# Altium project SpaceWallACPowerDistribution.PrjPcb (part 1 of 3)
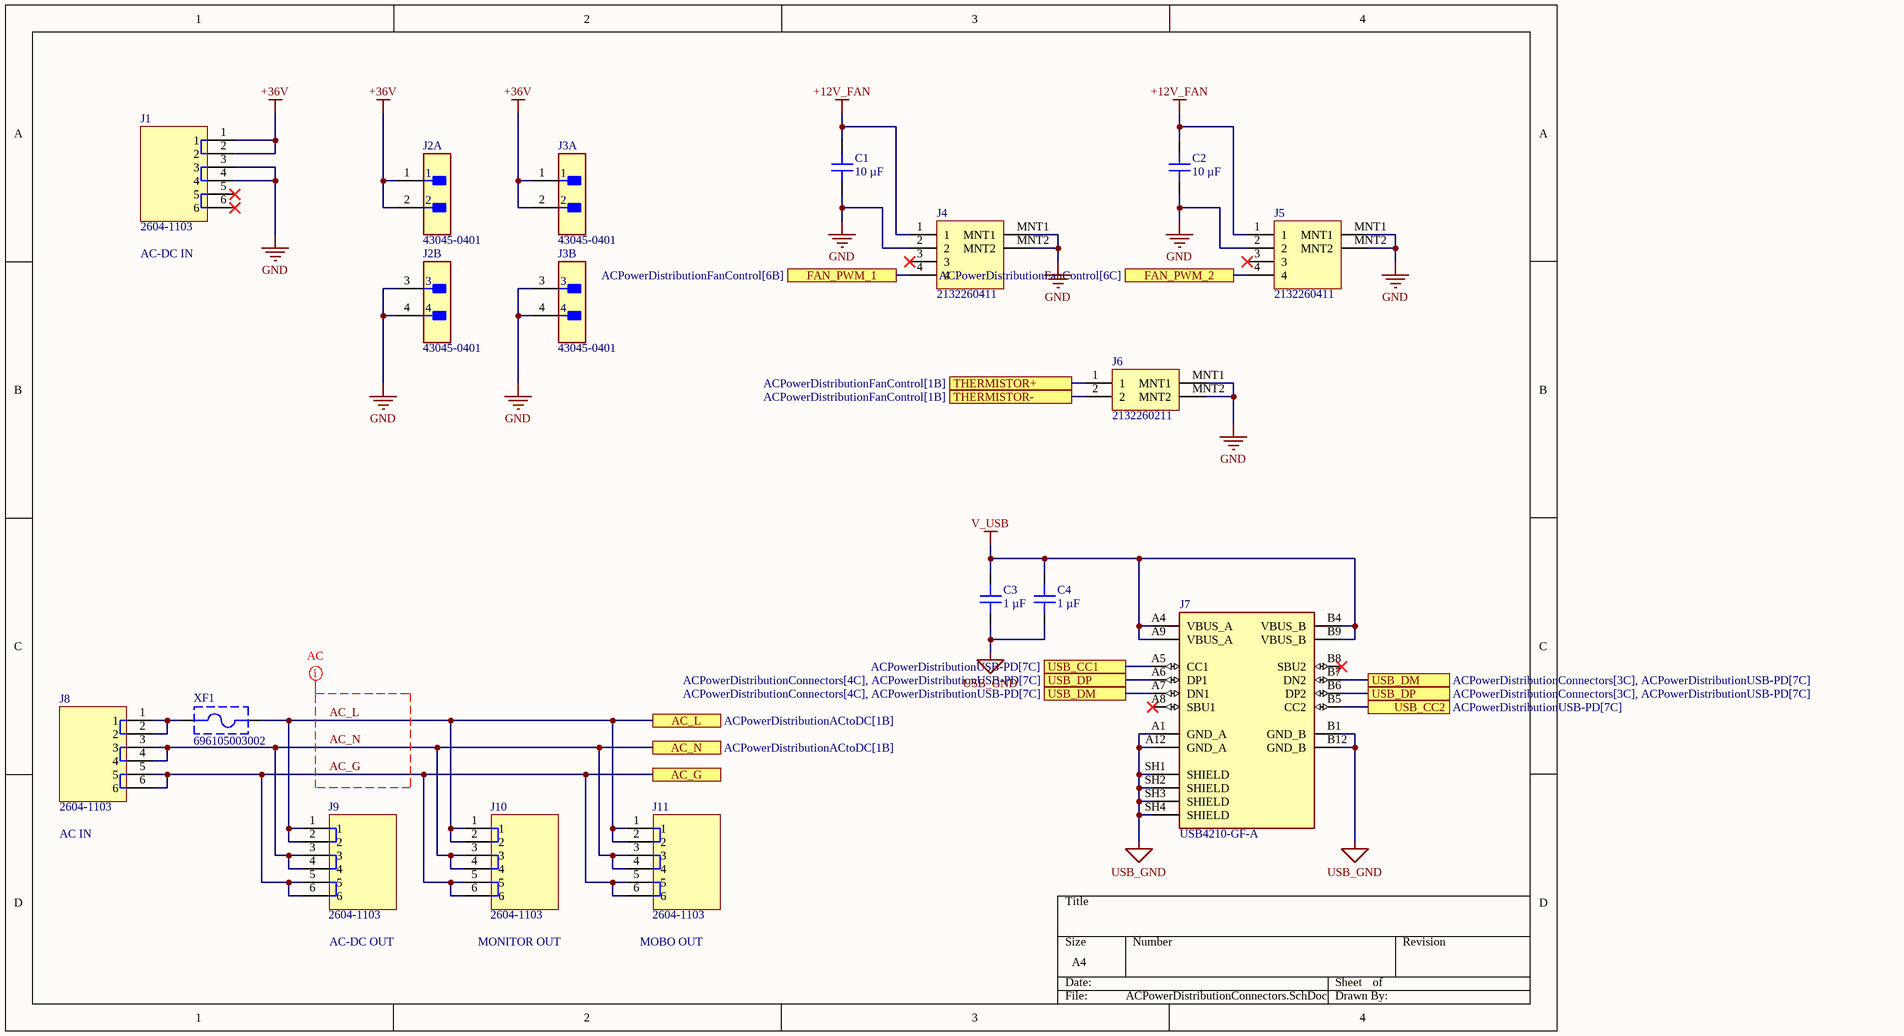
[diagram p0: ACPowerDistributionConnectors.SchDoc]
5 sheets, 157 parts. Net scope: flat (ports and power ports of the same name join across sheets).
Board file: ACPowerDistributionPCB.PcbDoc
Sheets:
  ACPowerDistributionConnectors.SchDoc
  ACPowerDistributionACtoDC.SchDoc
  ACPowerDistributionDCtoDC.SchDoc
  ACPowerDistributionUSB-PD.SchDoc
  ACPowerDistributionFanControl.SchDoc

## Sheet ACPowerDistributionConnectors.SchDoc
size A4; SheetNumber: 1; SheetTotal: 5

### Parts
C1  10 µF  [CAP 1210_3225 - 1MM]
C2  10 µF  [CAP 1210_3225 - 1MM]
C3  1 µF  [CAP 0603_1608]
C4  1 µF  [CAP 0603_1608]
J1  2604-1103  [2604-1103]
J2  43045-0401  [FP-43045-0401-MFG]  (parts A,B of 2)
J3  43045-0401  [FP-43045-0401-MFG]  (parts A,B of 2)
J4  2132260411  [2132260411]
J5  2132260411  [2132260411]
J6  2132260211  [2132260211]
J7  USB4210-GF-A  [USB4210-GF-A]
J8  2604-1103  [2604-1103]
J9  2604-1103  [2604-1103]
J10  2604-1103  [2604-1103]
J11  2604-1103  [2604-1103]
XF1  696105003002  [696105003002]

### Ports
AC_G, AC_L (see ACPowerDistributionACtoDC[1B]), AC_N (see ACPowerDistributionACtoDC[1B]), FAN_PWM_1 (see ACPowerDistributionFanControl[6B]), FAN_PWM_2 (see ACPowerDistributionFanControl[6C]), THERMISTOR+ (see ACPowerDistributionFanControl[1B]), THERMISTOR- (see ACPowerDistributionFanControl[1B]), USB_CC1 (see ACPowerDistributionUSB-PD[7C]), USB_CC2 (see ACPowerDistributionUSB-PD[7C]), USB_DM (see ACPowerDistributionConnectors[3C], ACPowerDistributionUSB-PD[7C]), USB_DM (see ACPowerDistributionConnectors[4C], ACPowerDistributionUSB-PD[7C]), USB_DP (see ACPowerDistributionConnectors[3C], ACPowerDistributionUSB-PD[7C]), USB_DP (see ACPowerDistributionConnectors[4C], ACPowerDistributionUSB-PD[7C])

### Nets
+5V: J6.1 ; port THERMISTOR+
+12V_FAN: C1.2 C2.2 J4.1 J5.1
+36V: J1.1 J1.2 J2.1 J2.2 J3.1 J3.2
GND: C1.1 C2.1 J1.3 J1.4 J2.3 J2.4 J3.3 J3.4 J4.2 J4.MNT1 J4.MNT2 J5.2 J5.MNT1 J5.MNT2 J6.MNT1 J6.MNT2
USB_GND: C3.1 C4.1 J7.A1(GND_A) J7.A12(GND_A) J7.B1(GND_B) J7.B12(GND_B) J7.SH1(SHIELD) J7.SH2(SHIELD) J7.SH3(SHIELD) J7.SH4(SHIELD)
V_USB: C3.2 C4.2 J7.A4(VBUS_A) J7.A9(VBUS_A) J7.B4(VBUS_B) J7.B9(VBUS_B)
AC_G: J8.5 J8.6 J9.5 J9.6 J10.5 J10.6 J11.5 J11.6 ; port AC_G
AC_L: J9.1 J9.2 J10.1 J10.2 J11.1 J11.2 XF1.2 ; port AC_L
AC_N: J8.3 J8.4 J9.3 J9.4 J10.3 J10.4 J11.3 J11.4 ; port AC_N
FAN_PWM_1: J4.4 ; port FAN_PWM_1
FAN_PWM_2: J5.4 ; port FAN_PWM_2
THERM_IN: J6.2 ; port THERMISTOR-
USB_CC1: J7.A5(CC1) ; port USB_CC1
USB_CC2: J7.B5(CC2) ; port USB_CC2
USB_DM: J7.A7(DN1) J7.B7(DN2) ; port USB_DM
USB_DP: J7.A6(DP1) J7.B6(DP2) ; port USB_DP
NetJ8_1: J8.1 J8.2 XF1.1

Not connected (* = marked no-connect by the designer): J1 5* 6*; J4 3*; J5 3*; J7 A8(SBU1)* B8(SBU2)*

### Layout directives
net class AC: AC_G, AC_L, AC_N

### Notes on the sheet
- (near J1) AC-DC IN
- AC IN
- (near J9) AC-DC OUT
- (near J10) MONITOR OUT
- (near J11) MOBO OUT

### Library data of the parts
C1 C2 = CGA6P1X7R1N106K250AC: CAP CER 10UF 75V X7R 1210; manufacturer: TDK Corporation; Tolerance: ±10%; Part Number: CGA6P1X7R1N106K250AC; Value: 10 µF; Applications: Automotive; Capacitance: 10 µF; componentlink1description: Datasheet; componentlink1url: https://product.tdk.com/info/en/catalog/datasheets/mlcc_automotive_general_en.pdf?ref_disty=digikey; componentlink2description: DigiKey Link; componentlink2url: https://www.digikey.com/en/products/detail/tdk-corporation/CGA6P1X7R1N106K250AC/10240635; Device Package: 1210 (3225 Metric); lastupdated: 6/4/2024 7:21:00 PM; Lifecycle Status: Active; Minimum Order: 1; Mounting Type: Surface Mount, MLCC; Operating Temperature: -55°C ~ 125°C; Package / Case: 1210 (3225 Metric); packaging: TapeAndReel; partid: 40572; Part Status: Active; price: 0.30; series: CGA; Size / Dimension: 0.126" L x 0.098" W (3.20mm x 2.50mm); Supplier 1: DigiKey; Supplier Part Number 1: 445-181658-1-ND; Temperature Coefficient: X7R; Thickness (Max): 0.110" (2.80mm); Voltage - Rated: 75V; Features: Low ESL; Ratings: AEC-Q200
C3 C4 = CL10A105KA8NNNC: CAP CER 1UF 25V X5R 0603; manufacturer: Samsung Electro-Mechanics; Tolerance: ±10%; Part Number: CL10A105KA8NNNC; Capacitance: 1 µF; Applications: General Purpose; componentlink1description: Datasheet; componentlink1url: http://www.samsungsem.com/kr/support/product-search/mlcc/CL10A105KA8NNNC.jsp; componentlink2description: DigiKey Link; componentlink2url: https://www.digikey.com/en/products/detail/samsung-electro-mechanics/CL10A105KA8NNNC/3886760; Device Package: 0603 (1608 Metric); lastupdated: 2/9/2024 8:10:26 PM; Lifecycle Status: Active; Minimum Order: 1; Mounting Type: Surface Mount, MLCC; Operating Temperature: -55°C ~ 85°C; Package / Case: 0603 (1608 Metric); packaging: TapeAndReel; partid: 5508; Part Status: Active; price: 0.01; series: CL; Size / Dimension: 0.063" L x 0.031" W (1.60mm x 0.80mm); Supplier 1: DigiKey; Supplier Part Number 1: 1276-1102-1-ND; Temperature Coefficient: X5R; Thickness (Max): 0.035" (0.90mm); value: 1 µF; Voltage - Rated: 25V
J2 J3 = CMP-04776-000440-1: MICROFIT 3.0 RA HDR W/TH DR 15AU; Row Spacing: 3mm; Max Current Rating: 5A; Gender: Male; Number of Contacts: 4; Voltage Rating: 250V; Max Voltage Rating (DC): 250.25kV; Glow Wire Compliant: Compliant; Contact Resistance: 10mR; System: Connector; RoHS Compliant: Yes; Max Operating Temperature: 105°C; Number of Rows: 2; Mount: Through Hole; Color: Black; Packaging: Tray; Series: 43045; Current Rating: 5A; Pitch: 3mm; Package Quantity: 2232; Depth: 12.2mm; Radiation Hardening: No; Height: 8.77mm; Contact Material: Brass; Length: 10.15mm; Contact Plating: Gold; Flammability Rating: UL94 V-0; Termination: Solder; Min Operating Temperature: -40°C; Housing Color: Black; Orientation: Right Angle; Number of Positions: 4; Case/Package: SMC; Number of Circuits: 4; Housing Material: Thermoplastic; Halogen Free: Low Halogen
XF1 = CMP-1502-00234-2: NexarPartId: 56808804; Voltage Rating (AC): 250V; Fuse Current: 10A; RoHS: Non-Compliant; REACH SVHC: Unknown; Packaging: Box; Mount: Through Hole
J1 J8-J11 = 2604-1103: Supplier 1: DigiKey; Supplier Part Number 1: 2946-2604-1103-ND
J4 J5 = 2132260411: Supplier 1: DigiKey; Supplier Part Number 1: 900-2132260411CT-ND
J6 = 2132260211: Supplier 1: DigiKey; Supplier Part Number 1: 900-2132260211CT-ND
J7 = USB4210-GF-A: Supplier 1: DigiKey; Supplier Part Number 1: 2073-USB4210-GF-ACT-ND

## Sheet ACPowerDistributionACtoDC.SchDoc
size A; SheetNumber: 2; SheetTotal: 5
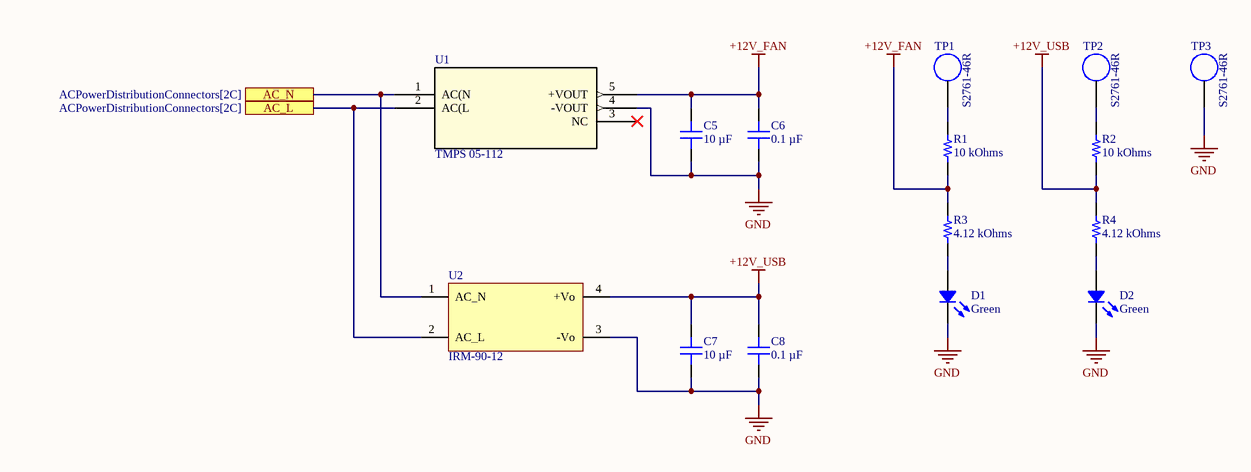
[diagram p1: ACPowerDistributionACtoDC.SchDoc]

### Parts
C5  10 µF  [CAP 1210_3225 - 1MM]
C6  0.1 µF  [CAP 0603_1608]
C7  10 µF  [CAP 1210_3225 - 1MM]
C8  0.1 µF  [CAP 0603_1608]
D1  Green  [LED 0603_1608 GREEN]
D2  Green  [LED 0603_1608 GREEN]
R1  10 kOhms  [RES 0603_1608]
R2  10 kOhms  [RES 0603_1608]
R3  4.12 kOhms  [RES 0603_1608]
R4  4.12 kOhms  [RES 0603_1608]
TP1  S2761-46R  [S2761-46R]
TP2  S2761-46R  [S2761-46R]
TP3  S2761-46R  [S2761-46R]
U1  TMPS 05-112  [TMPS05_TRP]
U2  IRM-90-12  [IRM-90-12]

### Ports
AC_L (see ACPowerDistributionConnectors[2C]), AC_N (see ACPowerDistributionConnectors[2C])

### Nets
+12V_FAN: C5.2 C6.2 R1.1 R3.2 U1.5(+VOUT)
+12V_USB: C7.2 C8.2 R2.1 R4.2 U2.4(+Vo)
GND: C5.1 C6.1 C7.1 C8.1 D1.2 D2.2 TP3.1 U1.4(-VOUT) U2.3(-Vo)
AC_L: U1.2(AC(L) U2.2(AC_L) ; port AC_L
AC_N: U1.1(AC(N) U2.1(AC_N) ; port AC_N
NetD1_1: D1.1 R3.1
NetD2_1: D2.1 R4.1
NetR1_2: R1.2 TP1.1
NetR2_2: R2.2 TP2.1

Not connected (* = marked no-connect by the designer): U1 3(NC)*

### Library data of the parts
C5 C7 = CGA6P1X7R1N106K250AC: as C1 on sheet ACPowerDistributionConnectors; Part Number: CGA6P1X7R1N106K250AC; Value: 10 µF; Applications: Automotive; Capacitance: 10 µF; componentlink1description: Datasheet; componentlink1url: https://product.tdk.com/info/en/catalog/datasheets/mlcc_automotive_general_en.pdf?ref_disty=digikey; componentlink2description: DigiKey Link; componentlink2url: https://www.digikey.com/en/products/detail/tdk-corporation/CGA6P1X7R1N106K250AC/10240635; Device Package: 1210 (3225 Metric); lastupdated: 6/4/2024 7:21:00 PM; Lifecycle Status: Active; Minimum Order: 1; Mounting Type: Surface Mount, MLCC; Operating Temperature: -55°C ~ 125°C; Package / Case: 1210 (3225 Metric); packaging: TapeAndReel; partid: 40572; Part Status: Active; price: 0.30; series: CGA; Size / Dimension: 0.126" L x 0.098" W (3.20mm x 2.50mm); Supplier 1: DigiKey; Supplier Part Number 1: 445-181658-1-ND; Temperature Coefficient: X7R; Thickness (Max): 0.110" (2.80mm); Voltage - Rated: 75V; Features: Low ESL; Ratings: AEC-Q200
C6 C8 = CL10B104KA8WPNC: CAP CER 0.1UF 25V X7R 0603; manufacturer: Samsung Electro-Mechanics; Tolerance: ±10%; Part Number: CL10B104KA8WPNC; Capacitance: 0.1 µF; Applications: Automotive; componentlink1description: Datasheet; componentlink1url: http://www.samsungsem.com/kr/support/product-search/mlcc/CL10B104KA8WPNC.jsp; componentlink2description: DigiKey Link; componentlink2url: https://www.digikey.com/en/products/detail/samsung-electro-mechanics/CL10B104KA8WPNC/5961201; Device Package: 0603 (1608 Metric); Features: Open Mode; lastupdated: 2/9/2024 8:10:26 PM; Lifecycle Status: Active; Minimum Order: 1; Mounting Type: Surface Mount, MLCC; Operating Temperature: -55°C ~ 125°C; Package / Case: 0603 (1608 Metric); packaging: TapeAndReel; partid: 5631; Part Status: Active; price: 0.01; Ratings: AEC-Q200; series: CL; Size / Dimension: 0.063" L x 0.031" W (1.60mm x 0.80mm); Supplier 1: DigiKey; Supplier Part Number 1: 1276-6717-1-ND; Temperature Coefficient: X7R; Thickness (Max): 0.035" (0.90mm); value: 0.1 µF; Voltage - Rated: 25V
D1 D2 = 150060VS75020: LED GREEN CLEAR 0603 SMD; Manufacturer: Würth Elektronik; Configuration: Independent; Current - Test: 20mA; Lens Color: Colorless; Lens Size: 1.10mm x 0.80mm; Lens Style: Rectangle with Flat Top; Millicandela Rating: 50mcd; Viewing Angle: 140°; Voltage - Forward (Vf) (Typ): 2V; Wavelength - Dominant: 570nm; Wavelength - Peak: 572nm; Part Number: 150060VS75020; Color: Green; ComponentLink2Description: DigiKey Link; ComponentLink2URL: https://www.digikey.com/en/products/detail/würth-elektronik/150060VS75020/10468264; Device Package: 0603 (1608 Metric); Height (Max): 0.45mm; LastUpdated: 8/25/2025 8:35:25 PM; Lens Transparency: Clear; Lifecycle Status: Active; Minimum Order: 1; Mounting Type: Surface Mount; Package / Case: 0603 (1608 Metric); Packaging: TapeAndReel; PartId: 588; Part Status: Active; Price: 0.17; Series: WL-SMCW; Size / Dimension: 1.60mm L x 0.80mm W; Supplier 1: DigiKey; Supplier Part Number 1: 732-150060VS75020CT-ND; Supplier Device Package: 0603; Value: Green
R1 R2 = RMCF0603FT10K0: RES 10K OHM 1% 1/10W 0603; Manufacturer: Stackpole Electronics Inc; Power (Watts): 0.1W, 1/10W; Temperature Coefficient: ±100ppm/°C; Part Number: RMCF0603FT10K0; Value: 10 kOhms; ComponentLink1Description: Datasheet; ComponentLink1URL: https://www.seielect.com/catalog/sei-rmcf_rmcp.pdf; ComponentLink2Description: DigiKey Link; ComponentLink2URL: https://www.digikey.com/en/products/detail/stackpole-electronics-inc/RMCF0603FT10K0/1761235; Composition: Thick Film; Device Package: 0603 (1608 Metric); Features: Automotive AEC-Q200; Height - Seated (Max): 0.022" (0.55mm); LastUpdated: 2/9/2024 8:42:00 PM; Lifecycle Status: Active; Minimum Order: 1; Number of Terminations: 2; Operating Temperature: -55°C ~ 155°C; Package / Case: 0603 (1608 Metric); Packaging: CutTape; PartId: 25663; Part Status: Active; Price: 0.01; Ratings: AEC-Q200; Resistance: 10 kOhms; Series: RMCF; Size / Dimension: 0.061" L x 0.031" W (1.55mm x 0.80mm); Supplier 1: DigiKey; Supplier Part Number 1: RMCF0603FT10K0CT-ND; Supplier Device Package: 0603; Tolerance: ±1%
R3 R4 = RMCF0603FT4K12: RES 4.12K OHM 1% 1/10W 0603; Manufacturer: Stackpole Electronics Inc; Power (Watts): 0.1W, 1/10W; Temperature Coefficient: ±100ppm/°C; Part Number: RMCF0603FT4K12; Value: 4.12 kOhms; ComponentLink1Description: Datasheet; ComponentLink1URL: https://www.seielect.com/catalog/sei-rmcf_rmcp.pdf; ComponentLink2Description: DigiKey Link; ComponentLink2URL: https://www.digikey.com/en/products/detail/stackpole-electronics-inc/RMCF0603FT4K12/1713994; Composition: Thick Film; Device Package: 0603 (1608 Metric); Features: Automotive AEC-Q200; Height - Seated (Max): 0.022" (0.55mm); LastUpdated: 2/9/2024 8:42:56 PM; Lifecycle Status: Active; Minimum Order: 1; Number of Terminations: 2; Operating Temperature: -55°C ~ 155°C; Package / Case: 0603 (1608 Metric); Packaging: CutTape; PartId: 15250; Part Status: Active; Price: 0.01; Ratings: AEC-Q200; Resistance: 4.12 kOhms; Series: RMCF; Size / Dimension: 0.061" L x 0.031" W (1.55mm x 0.80mm); Supplier 1: DigiKey; Supplier Part Number 1: RMCF0603FT4K12CT-ND; Supplier Device Package: 0603; Tolerance: ±1%
U1 = CMP-01539-65687566-1: TMPS 05-112 AC/DC Power Supply Single-OUT 12V 0.416A 5W 5-Pin; Number of Outputs: 1; Efficiency: 81%; Output Current: 540mA; Min Operating Temperature: -25°C; Width: 25.4mm; Output Voltage: 12V; Power Rating: 5W; Height: 16.3mm; Length: 25.4mm; RoHS: Non-Compliant; NexarPartId: 65687566; Output Power: 5W; Max Operating Temperature: 70°C; Depth: 15.3mm
TP1-TP3 = S2761-46R: Supplier 1: DigiKey; Supplier Part Number 1: 952-2665-1-ND
U2 = IRM-90-12: Supplier 1: RS (Formerly Allied Electronics); Supplier Part Number 1: 71939990

## Sheet ACPowerDistributionDCtoDC.SchDoc
size A; SheetNumber: 3; SheetTotal: 5
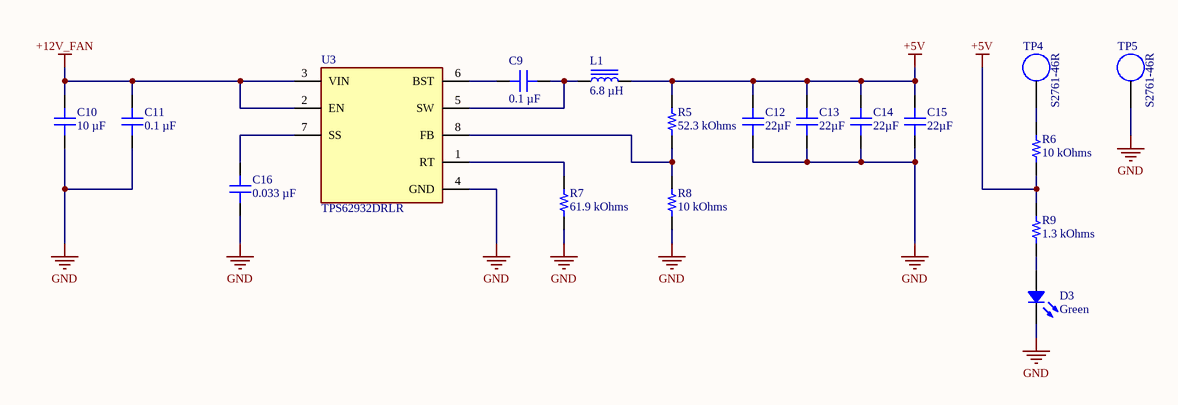
[diagram p2: ACPowerDistributionDCtoDC.SchDoc]

### Parts
C9  0.1 µF  [CAP 0603_1608]
C10  10 µF  [CAP 1210_3225 - 1MM]
C11  0.1 µF  [CAP 0603_1608]
C12  22µF  [CAP 1210_3225 - 2.8MM]
C13  22µF  [CAP 1210_3225 - 2.8MM]
C14  22µF  [CAP 1210_3225 - 2.8MM]
C15  22µF  [CAP 1210_3225 - 2.8MM]
C16  0.033 µF  [CAP 0603_1608]
D3  Green  [LED 0603_1608 GREEN]
L1  6.8 µH  [WURTH WE-LQS 6045]
R5  52.3 kOhms  [YAGEO RES 0603_1608]
R6  10 kOhms  [RES 0603_1608]
R7  61.9 kOhms  [RES 0603_1608]
R8  10 kOhms  [RES 0603_1608]
R9  1.3 kOhms  [RES 0603_1608]
TP4  S2761-46R  [S2761-46R]
TP5  S2761-46R  [S2761-46R]
U3  TPS62932DRLR  [FP-DRL0008A-MFG]

### Nets
+5V: C12.2 C13.2 C14.2 C15.2 L1.2 R5.2 R6.1 R9.2
+12V_FAN: C10.2 C11.2 U3.2(EN) U3.3(VIN)
GND: C10.1 C11.1 C12.1 C13.1 C14.1 C15.1 C16.1 D3.2 R7.1 R8.1 TP5.1 U3.4(GND)
NetC9_1: C9.1 L1.1 U3.5(SW)
NetC9_2: C9.2 U3.6(BST)
NetC16_2: C16.2 U3.7(SS)
NetD3_1: D3.1 R9.1
NetR5_1: R5.1 R8.2 U3.8(FB)
NetR6_2: R6.2 TP4.1
NetR7_2: R7.2 U3.1(RT)

### Library data of the parts
C9 C11 = CL10B104KA8WPNC: as C6 on sheet ACPowerDistributionACtoDC; Part Number: CL10B104KA8WPNC; Capacitance: 0.1 µF; Applications: Automotive; componentlink1description: Datasheet; componentlink1url: http://www.samsungsem.com/kr/support/product-search/mlcc/CL10B104KA8WPNC.jsp; componentlink2description: DigiKey Link; componentlink2url: https://www.digikey.com/en/products/detail/samsung-electro-mechanics/CL10B104KA8WPNC/5961201; Device Package: 0603 (1608 Metric); Features: Open Mode; lastupdated: 2/9/2024 8:10:26 PM; Lifecycle Status: Active; Minimum Order: 1; Mounting Type: Surface Mount, MLCC; Operating Temperature: -55°C ~ 125°C; Package / Case: 0603 (1608 Metric); packaging: TapeAndReel; partid: 5631; Part Status: Active; price: 0.01; Ratings: AEC-Q200; series: CL; Size / Dimension: 0.063" L x 0.031" W (1.60mm x 0.80mm); Supplier 1: DigiKey; Supplier Part Number 1: 1276-6717-1-ND; Temperature Coefficient: X7R; Thickness (Max): 0.035" (0.90mm); value: 0.1 µF; Voltage - Rated: 25V
C10 = CGA6P1X7R1N106K250AC: as C1 on sheet ACPowerDistributionConnectors; Part Number: CGA6P1X7R1N106K250AC; Value: 10 µF; Applications: Automotive; Capacitance: 10 µF; componentlink1description: Datasheet; componentlink1url: https://product.tdk.com/info/en/catalog/datasheets/mlcc_automotive_general_en.pdf?ref_disty=digikey; componentlink2description: DigiKey Link; componentlink2url: https://www.digikey.com/en/products/detail/tdk-corporation/CGA6P1X7R1N106K250AC/10240635; Device Package: 1210 (3225 Metric); lastupdated: 6/4/2024 7:21:00 PM; Lifecycle Status: Active; Minimum Order: 1; Mounting Type: Surface Mount, MLCC; Operating Temperature: -55°C ~ 125°C; Package / Case: 1210 (3225 Metric); packaging: TapeAndReel; partid: 40572; Part Status: Active; price: 0.30; series: CGA; Size / Dimension: 0.126" L x 0.098" W (3.20mm x 2.50mm); Supplier 1: DigiKey; Supplier Part Number 1: 445-181658-1-ND; Temperature Coefficient: X7R; Thickness (Max): 0.110" (2.80mm); Voltage - Rated: 75V; Features: Low ESL; Ratings: AEC-Q200
C12-C15 = 1210YC226KAT4A: CAP CER 22UF 16V X7R 1210; manufacturer: AVX Corporation; Tolerance: ±10%; Part Number: 1210YC226KAT4A; Value: 22µF; Applications: General Purpose; Capacitance: 22µF; componentlink1description: Datasheet; componentlink1url: http://datasheets.avx.com/X7RDielectric.pdf; componentlink2description: DigiKey Link; componentlink2url: http://digikey.com/product-detail/en/avx-corporation/1210YC226KAT4A/478-11529-1-ND/8107730; Device Package: 1210 (3225 Metric); lastupdated: 9/2/2020 1:10:51 AM; Lifecycle Status: Active; Minimum Order: 1; Mounting Type: Surface Mount, MLCC; Operating Temperature: -55°C ~ 125°C; Package / Case: 1210 (3225 Metric); packaging: TapeAndReel; partid: 23855; Part Status: Active; price: 0.48; series: -; Size / Dimension: 0.126" L x 0.098" W (3.20mm x 2.50mm); Supplier 1: DigiKey; Supplier Part Number 1: 478-11529-1-ND; Temperature Coefficient: X7R; Thickness (Max): 0.110" (2.79mm); Voltage - Rated: 16V
C16 = CC0603KRX7R7BB333: CAP CER 0.033UF 16V X7R 0603; manufacturer: Yageo; Tolerance: ±10%; Part Number: CC0603KRX7R7BB333; Capacitance: 0.033 µF; Applications: General Purpose; componentlink1description: Datasheet; componentlink1url: https://www.yageo.com/upload/media/product/productsearch/datasheet/mlcc/UPY-GPHC_X7R_6.3V-to-50V_18.pdf; componentlink2description: DigiKey Link; componentlink2url: https://www.digikey.com/en/products/detail/yageo/CC0603KRX7R7BB333/5883762; Device Package: 0603 (1608 Metric); lastupdated: 2/9/2024 8:10:21 PM; Lifecycle Status: Active; Minimum Order: 1; Mounting Type: Surface Mount, MLCC; Operating Temperature: -55°C ~ 125°C; Package / Case: 0603 (1608 Metric); packaging: TapeAndReel; partid: 9464; Part Status: Active; price: 0.01; series: CC; Size / Dimension: 0.063" L x 0.031" W (1.60mm x 0.80mm); Supplier 1: DigiKey; Supplier Part Number 1: 311-4071-1-ND; Temperature Coefficient: X7R; Thickness (Max): 0.035" (0.90mm); value: 0.033 µF; Voltage - Rated: 16V
D3 = 150060VS75020: as D1 on sheet ACPowerDistributionACtoDC; Part Number: 150060VS75020; Color: Green; ComponentLink2Description: DigiKey Link; ComponentLink2URL: https://www.digikey.com/en/products/detail/würth-elektronik/150060VS75020/10468264; Device Package: 0603 (1608 Metric); Height (Max): 0.45mm; LastUpdated: 8/25/2025 8:35:25 PM; Lens Transparency: Clear; Lifecycle Status: Active; Minimum Order: 1; Mounting Type: Surface Mount; Package / Case: 0603 (1608 Metric); Packaging: TapeAndReel; PartId: 588; Part Status: Active; Price: 0.17; Series: WL-SMCW; Size / Dimension: 1.60mm L x 0.80mm W; Supplier 1: DigiKey; Supplier Part Number 1: 732-150060VS75020CT-ND; Supplier Device Package: 0603; Value: Green
L1 = 74404064068: FIXED IND 6.8UH 3A 31 MOHM SMD; Manufacturer: Würth Elektronik; Current - Saturation: 4.3A; DC Resistance (DCR): 31mOhm; Frequency - Self Resonant: 27MHz; Inductance Frequency - Test: 100 kHz; Material - Core: Ferrite; Shielding: Shielded; Tolerance: ±20%; Type: Drum Core, Wirewound; Part Number: 74404064068; ComponentLink1Description: Datasheet; ComponentLink1URL: https://katalog.we-online.de/pbs/datasheet/74404064068.pdf; ComponentLink2Description: DigiKey Link; ComponentLink2URL: https://www.digikey.com/en/products/detail/würth-elektronik/74404064068/4865692; Current Rating (Amps): 3 A; Device Package: Nonstandard; Height - Seated (Max): 0.177" (4.50mm); Inductance: 6.8 µH; LastUpdated: 6/3/2024 8:27:17 PM; Lifecycle Status: Active; Minimum Order: 1; Mounting Type: Surface Mount; Operating Temperature: -40°C ~ 125°C; Package / Case: Nonstandard; Packaging: TapeAndReel; PartId: 3696; Part Status: Active; Price: 0.74; Ratings: AEC-Q200; Series: WE-LQS; Size / Dimension: 0.236" L x 0.236" W (6.00mm x 6.00mm); Supplier 1: DigiKey; Supplier Part Number 1: 732-5547-1-ND; Supplier Device Package: 6045; Value: 6.8 µH
R5 = RT0603BRE0752K3L: RES SMD 52.3KOHM 0.1% 1/10W 0603; Manufacturer: Yageo; Power (Watts): 0.1W, 1/10W; Temperature Coefficient: ±50ppm/°C; Part Number: RT0603BRE0752K3L; Value: 52.3 kOhms; ComponentLink1Description: Datasheet; ComponentLink1URL: https://www.yageo.com/upload/media/product/app/datasheet/rchip/pyu-rt_1-to-0.01_rohs_l.pdf; ComponentLink2Description: DigiKey Link; ComponentLink2URL: https://www.digikey.com/en/products/detail/yageo/RT0603BRE0752K3L/1073082; Composition: Thin Film; Device Package: 0603 (1608 Metric); Height - Seated (Max): 0.022" (0.55mm); LastUpdated: 7/25/2024 9:18:48 AM; Lifecycle Status: Active; Minimum Order: 1; Number of Terminations: 2; Operating Temperature: -55°C ~ 155°C; Package / Case: 0603 (1608 Metric); Packaging: TapeAndReel; PartId: 86295; Price: 0.04; Resistance: 52.3 kOhms; Series: RT; Size / Dimension: 0.063" L x 0.031" W (1.60mm x 0.80mm); Supplier 1: DigiKey; Supplier Part Number 1: 13-RT0603BRE0752K3LCT-ND; Supplier Device Package: 0603; Tolerance: ±0.1%
R6 R8 = RMCF0603FT10K0: as R1 on sheet ACPowerDistributionACtoDC; Part Number: RMCF0603FT10K0; Value: 10 kOhms; ComponentLink1Description: Datasheet; ComponentLink1URL: https://www.seielect.com/catalog/sei-rmcf_rmcp.pdf; ComponentLink2Description: DigiKey Link; ComponentLink2URL: https://www.digikey.com/en/products/detail/stackpole-electronics-inc/RMCF0603FT10K0/1761235; Composition: Thick Film; Device Package: 0603 (1608 Metric); Features: Automotive AEC-Q200; Height - Seated (Max): 0.022" (0.55mm); LastUpdated: 2/9/2024 8:42:00 PM; Lifecycle Status: Active; Minimum Order: 1; Number of Terminations: 2; Operating Temperature: -55°C ~ 155°C; Package / Case: 0603 (1608 Metric); Packaging: CutTape; PartId: 25663; Part Status: Active; Price: 0.01; Ratings: AEC-Q200; Resistance: 10 kOhms; Series: RMCF; Size / Dimension: 0.061" L x 0.031" W (1.55mm x 0.80mm); Supplier 1: DigiKey; Supplier Part Number 1: RMCF0603FT10K0CT-ND; Supplier Device Package: 0603; Tolerance: ±1%
R7 = RMCF0603FT61K9: RES 61.9K OHM 1% 1/10W 0603; Manufacturer: Stackpole Electronics Inc; Power (Watts): 0.1W, 1/10W; Temperature Coefficient: ±100ppm/°C; Part Number: RMCF0603FT61K9; Value: 61.9 kOhms; ComponentLink1Description: Datasheet; ComponentLink1URL: https://www.seielect.com/catalog/sei-rmcf_rmcp.pdf; ComponentLink2Description: DigiKey Link; ComponentLink2URL: https://www.digikey.com/en/products/detail/stackpole-electronics-inc/RMCF0603FT61K9/1760824; Composition: Thick Film; Device Package: 0603 (1608 Metric); Features: Automotive AEC-Q200; Height - Seated (Max): 0.022" (0.55mm); LastUpdated: 2/9/2024 8:43:09 PM; Lifecycle Status: Active; Minimum Order: 1; Number of Terminations: 2; Operating Temperature: -55°C ~ 155°C; Package / Case: 0603 (1608 Metric); Packaging: CutTape; PartId: 11746; Part Status: Active; Price: 0.01; Ratings: AEC-Q200; Resistance: 61.9 kOhms; Series: RMCF; Size / Dimension: 0.061" L x 0.031" W (1.55mm x 0.80mm); Supplier 1: DigiKey; Supplier Part Number 1: RMCF0603FT61K9CT-ND; Supplier Device Package: 0603; Tolerance: ±1%
R9 = RMCF0603JT1K30: RES 1.3K OHM 5% 1/10W 0603; Manufacturer: Stackpole Electronics Inc; Power (Watts): 0.1W, 1/10W; Temperature Coefficient: ±200ppm/°C; Part Number: RMCF0603JT1K30; Value: 1.3 kOhms; ComponentLink1Description: Datasheet; ComponentLink1URL: https://www.seielect.com/catalog/sei-rmcf_rmcp.pdf; ComponentLink2Description: DigiKey Link; ComponentLink2URL: https://www.digikey.com/en/products/detail/stackpole-electronics-inc/RMCF0603JT1K30/1757936; Composition: Thick Film; Device Package: 0603 (1608 Metric); Features: Automotive AEC-Q200; Height - Seated (Max): 0.022" (0.55mm); LastUpdated: 2/9/2024 8:43:28 PM; Lifecycle Status: Active; Minimum Order: 1; Number of Terminations: 2; Operating Temperature: -55°C ~ 155°C; Package / Case: 0603 (1608 Metric); Packaging: CutTape; PartId: 6974; Part Status: Active; Price: 0.01; Ratings: AEC-Q200; Resistance: 1.3 kOhms; Series: RMCF; Size / Dimension: 0.061" L x 0.031" W (1.55mm x 0.80mm); Supplier 1: DigiKey; Supplier Part Number 1: RMCF0603JT1K30CT-ND; Supplier Device Package: 0603; Tolerance: ±5%
U3 = CMP-04918-000714-1: 3.8-V TO 30-V INPUT, 2-A, 200-KH
TP4 TP5 = S2761-46R: Supplier 1: DigiKey; Supplier Part Number 1: 952-2665-1-ND